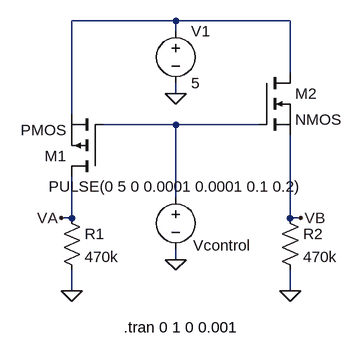
[diagram p0: schematic Switch 2 schematic.asc]
Switch 2 schematic.asc, the LTspice schematic file:
Version 4
SHEET 1 880 680
WIRE 304 64 144 64
WIRE 480 64 304 64
WIRE 304 80 304 64
WIRE 480 144 480 64
WIRE 304 176 304 160
WIRE 144 208 144 64
WIRE 304 224 192 224
WIRE 432 224 304 224
WIRE 304 336 304 224
WIRE 144 368 144 304
WIRE 144 368 128 368
WIRE 480 368 480 240
WIRE 496 368 480 368
WIRE 304 432 304 416
WIRE 144 480 144 448
WIRE 480 480 480 448
FLAG 144 480 0
FLAG 480 480 0
FLAG 304 176 0
FLAG 304 432 0
FLAG 128 368 VA
FLAG 496 368 VB
SYMBOL voltage 304 320 R0
WINDOW 0 27 90 Left 2
WINDOW 3 0 15 Bottom 2
WINDOW 123 0 0 Left 0
WINDOW 39 0 0 Left 0
SYMATTR InstName Vcontrol
SYMATTR Value PULSE(0 5 0 0.0001 0.0001 0.1 0.2)
SYMBOL pmos 192 304 R180
SYMATTR InstName M1
SYMBOL res 128 352 R0
SYMATTR InstName R1
SYMATTR Value 470k
SYMBOL nmos 432 144 R0
SYMATTR InstName M2
SYMBOL res 464 352 R0
SYMATTR InstName R2
SYMATTR Value 470k
SYMBOL voltage 304 64 R0
SYMATTR InstName V1
SYMATTR Value 5
TEXT 224 536 Left 2 !.tran 0 1 0 0.001

The netlist it stands for:
* Switch 2 schematic.asc
Vcontrol N002 0 PULSE(0 5 0 0.0001 0.0001 0.1 0.2)
M1 VA N002 N001 N001 PMOS
R1 VA 0 470k
M2 N001 N002 VB VB NMOS
R2 VB 0 470k
V1 N001 0 5
.model NMOS NMOS
.model PMOS PMOS
.lib standard.mos
.tran 0 1 0 0.001
.backanno
.end